# EAGLE schematic Wifi (EAGLE 7.2.0)
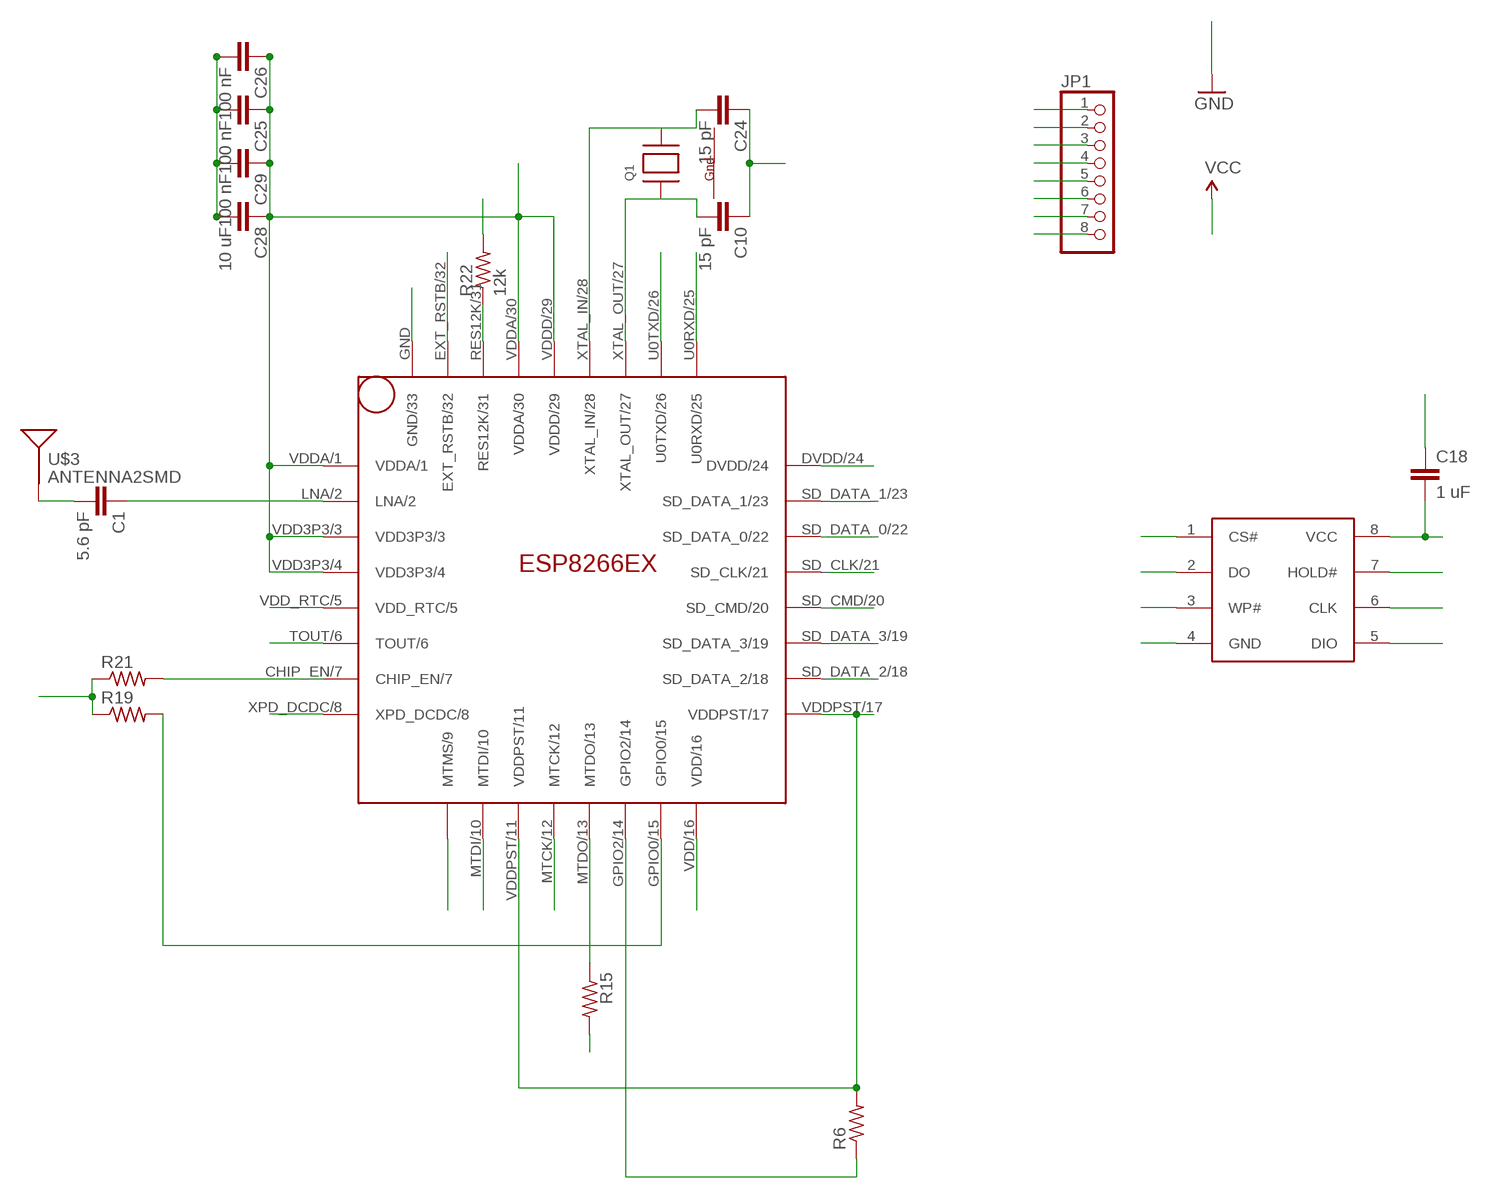
[diagram p0: schematic, sheet 1]

## Parts
C1  5.6 pF  CAP0402-CAP  [0402-CAP]
C10  15 pF  CAP0402-CAP  [0402-CAP]
C18  1 uF  CAP0402-CAP  [0402-CAP]
C24  15 pF  CAP0402-CAP  [0402-CAP]
C25  100 nF  CAP0402-CAP  [0402-CAP]
C26  100 nF  CAP0402-CAP  [0402-CAP]
C28  10 uF  CAP0402-CAP  [0402-CAP]
C29  100 nF  CAP0402-CAP  [0402-CAP]
JP1  PINHD-1X8BIG  [1X08-BIG]
Q1  XTAL-4-3225  [NX3225]
R6  R-US_M0805  [M0805]
R15  R-US_M0805  [M0805]
R19  R-US_M0805  [M0805]
R21  R-US_M0805  [M0805]
R22  12k  R-US_M0805  [M0805]
U$1  ESP8266EX  [QFN32]
U$2  25Q40  [SOP8]
U$3  ANTENNA2SMD  [ANTENNA-CHIP2]

## Nets
CHIP_EN: JP1.6 R21.2 U$1.CHIP_EN/7
CLK: U$1.SD_CLK/21 U$2.6(CLK)
CS: U$1.SD_CMD/20 U$2.1(CS#)
GND: C10.1 C18.1 C24.1 JP1.1 R15.2 R22.2 U$1.GND(GND/33) U$2.4(GND)
N$1: C1.2 U$3.FEED(SIGNAL)
N$2: R22.1 U$1.RES12K/31
N$3: C24.2 Q1.3(X2) U$1.XTAL_IN/28
N$4: C25.2 C26.2 C28.2 C29.2
N$5: C10.2 Q1.1(X1) U$1.XTAL_OUT/27
N$14: U$1.DVDD/24
N$21: R6.2 U$1.VDDPST/11 U$1.VDDPST/17
N$22: U$1.VDD/16
N$23: R19.2 U$1.GPIO0/15
N$24: R6.1 U$1.GPIO2/14
N$25: R15.1 U$1.MTDO/13
N$26: U$1.MTCK/12
N$28: U$1.MTDI/10
N$29: U$1.MTMS/9
N$30: U$1.XPD_DCDC/8
N$36: C1.1 U$1.LNA/2
RST: JP1.5 U$1.EXT_RSTB/32
RTC: JP1.8 U$1.VDD_RTC/5
RXD: JP1.3 U$1.U0RXD/25
SD0: U$1.SD_DATA_0/22 U$2.2(DO)
SD1: U$1.SD_DATA_1/23 U$2.5(DIO)
SD2: U$1.SD_DATA_2/18 U$2.7(HOLD#)
SD3: U$1.SD_DATA_3/19 U$2.3(WP#)
TOUT: JP1.7 U$1.TOUT/6
TXD: JP1.4 U$1.U0TXD/26
VCC: C25.1 C26.1 C28.1 C29.1 JP1.2 R19.1 R21.1 U$1.VDD3P3/3 U$1.VDD3P3/4 U$1.VDDA/1 U$1.VDDA/30 U$1.VDDD/29
VDD: C18.2 U$2.8(VCC) ; supply symbol labelled VCC

## Power pins joined to a net without a drawn wire
G1: Q1.4(G1)
G2: Q1.2(G2)

## Library data of the parts
C1 C10 C18 C24-C26 C28 C29 = SparkFun-Capacitors:CAP: Capacitor Standard 0603 ceramic capacitor, and 0.1" leaded capacitor.
JP1 = adafruit:PINHD-1X8: PIN HEADER
Q1 = adafruit:XTAL-4: Classic 4-pin 3.2 x 2.5mm crystal
R6 R15 R19 R21 R22 = resistor:R-US_: RESISTOR, American symbol
U$1 = wifi:ESP8266EX
U$2 = wifi:25Q40
U$3 = SparkFun-RF:ANTENNA2: Chip antenna Single endded antenna. Common with smaller chip antennas. CHIP4 package is the GPS Chip Antenna SKU: GPS-08418. CHIP5 package is 2.4GHz chip antenna SKU: WRL-00144.